# EAGLE schematic TI_MotorController (EAGLE 9.3.0)
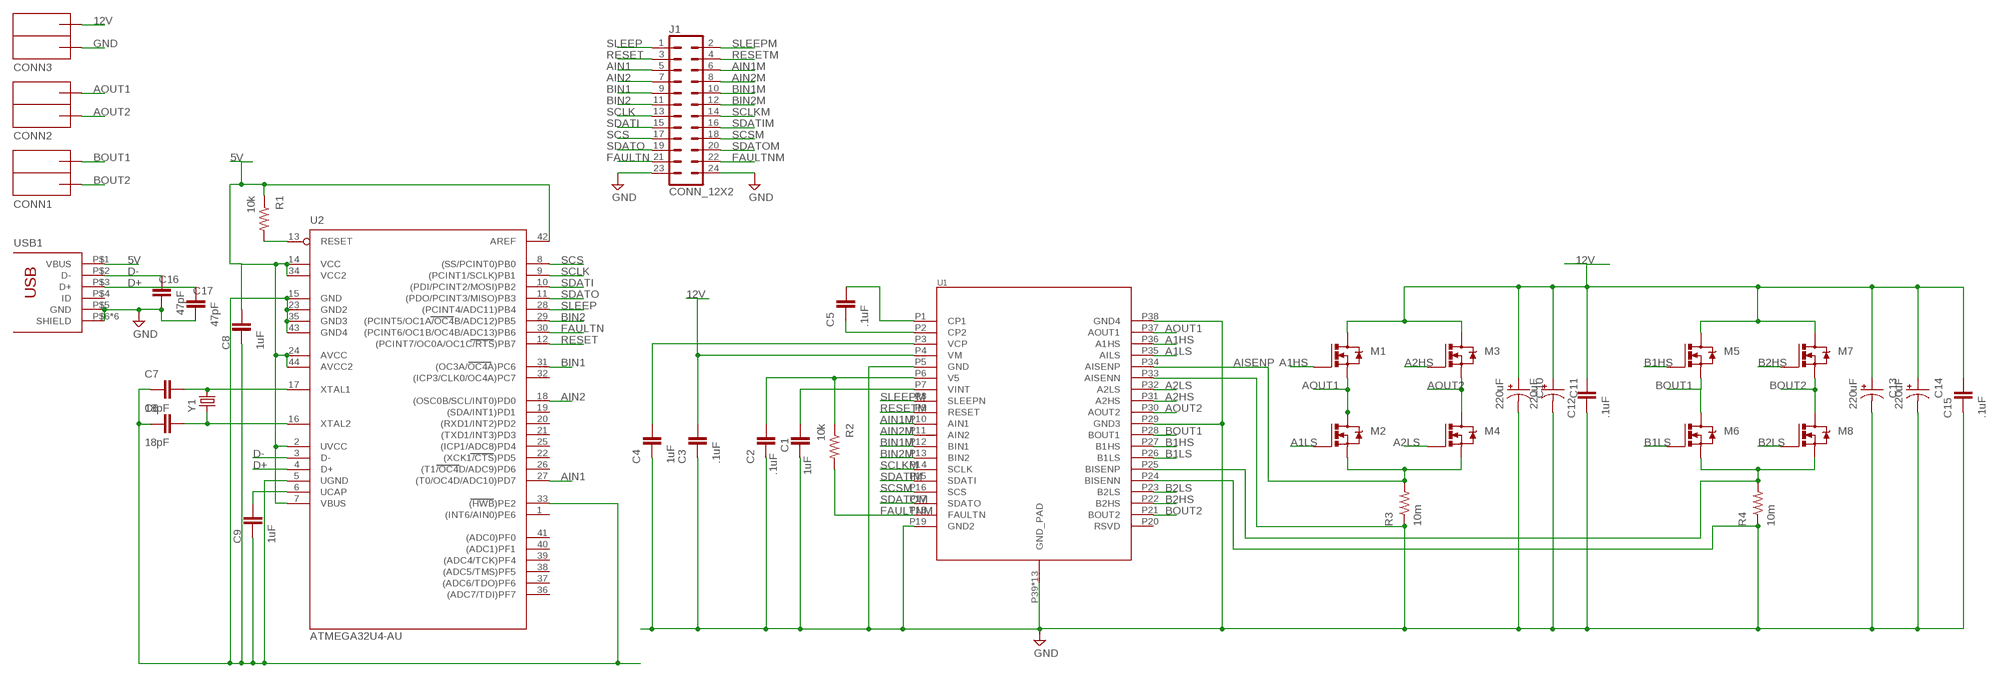
[diagram p0: schematic, sheet 1]

## Parts
C1  1uF  CAP0603-CAP  [0603-CAP]
C2  .1uF  CAP0603-CAP  [0603-CAP]
C3  .1uF  CAP0603-CAP  [0603-CAP]
C4  1uF  CAP0603-CAP  [0603-CAP]
C5  .1uF  CAP0603-CAP  [0603-CAP]
C6  18pF  CAP0603-CAP  [0603-CAP]
C7  18pF  CAP0603-CAP  [0603-CAP]
C8  1uF  CAP0603-CAP  [0603-CAP]
C9  1uF  CAP0603-CAP  [0603-CAP]
C10  220uF  CAP_POLF80  [NIPPON_F80]
C11  220uF  CAP_POLF80  [NIPPON_F80]
C12  .1uF  CAP0603-CAP  [0603-CAP]
C13  220uF  CAP_POLF80  [NIPPON_F80]
C14  220uF  CAP_POLF80  [NIPPON_F80]
C15  .1uF  CAP0603-CAP  [0603-CAP]
C16  47pF  CAP0603-CAP  [0603-CAP]
C17  47pF  CAP0603-CAP  [0603-CAP]
CONN1  ANDERSONVERTICAL  [ANDERSON_VERTICAL]
CONN2  ANDERSONVERTICAL  [ANDERSON_VERTICAL]
CONN3  ANDERSONVERTICAL  [ANDERSON_VERTICAL]
J1  CONN_12X2  [2X12]
M1  NMOS_CSD17579Q3A  [DNH0008A]
M2  NMOS_CSD17579Q3A  [DNH0008A]
M3  NMOS_CSD17579Q3A  [DNH0008A]
M4  NMOS_CSD17579Q3A  [DNH0008A]
M5  NMOS_CSD17579Q3A  [DNH0008A]
M6  NMOS_CSD17579Q3A  [DNH0008A]
M7  NMOS_CSD17579Q3A  [DNH0008A]
M8  NMOS_CSD17579Q3A  [DNH0008A]
R1  10k  R-US_R0603  [R0603]
R2  10k  R-US_R0603  [R0603]
R3  10m  R-US_R2512  [R2512]
R4  10m  R-US_R2512  [R2512]
U1  DRV8704  [HTSSOP(38)]
U2  ATMEGA32U4-AU  [TQFP44]
USB1  USB-OTGMICRO-AB  [USB-MICRO-AB]
Y1  CRYSTAL10.5X4.8  [CRYSTAL-SMD-10.5X4.8-2PIN]

## Nets
5V: C8.2 R1.1 U2.2(UVCC) U2.7(VBUS) U2.14(VCC) U2.24(AVCC) U2.34(VCC2) U2.42(AREF) U2.44(AVCC2) USB1.P$1(VBUS)
12V: C3.2 C10.+ C11.+ C12.2 C13.+ C14.+ C15.2 CONN3.PIN1(OUTB) M1.5(D) M1.6(D) M1.7(D) M1.8(D) M1.9(D) M3.5(D) M3.6(D) M3.7(D) M3.8(D) M3.9(D) M5.5(D) M5.6(D) M5.7(D) M5.8(D) M5.9(D) M7.5(D) M7.6(D) M7.7(D) M7.8(D) M7.9(D) U1.P4(VM)
A1HS: M1.4(G) U1.P36(A1HS)
A1LS: M2.4(G) U1.P35(AILS)
A2HS: M3.4(G) U1.P31(A2HS)
A2LS: M4.4(G) U1.P32(A2LS)
AIN1: J1.5 U2.27((T0/OC4D/ADC10)PD7)
AIN1M: J1.6 U1.P10(AIN1)
AIN2: J1.7 U2.18((OSC0B/SCL/INT0)PD0)
AIN2M: J1.8 U1.P11(AIN2)
AISENP: M2.1(S) M2.2(S) M2.3(S) M4.1(S) M4.2(S) M4.3(S) R3.2 U1.P34(AISENP)
AOUT1: CONN2.PIN1(OUTB) M1.1(S) M1.2(S) M1.3(S) M2.5(D) M2.6(D) M2.7(D) M2.8(D) M2.9(D) U1.P37(AOUT1)
AOUT2: CONN2.PIN2(OUTA) M3.1(S) M3.2(S) M3.3(S) M4.5(D) M4.6(D) M4.7(D) M4.8(D) M4.9(D) U1.P30(AOUT2)
B1HS: M5.4(G) U1.P27(B1HS)
B1LS: M6.4(G) U1.P26(B1LS)
B2HS: M7.4(G) U1.P22(B2HS)
B2LS: M8.4(G) U1.P23(B2LS)
BIN1: J1.9 U2.31((OC3A/OC4A)PC6)
BIN1M: J1.10 U1.P12(BIN1)
BIN2: J1.11 U2.29((PCINT5/OC1A/OC4B/ADC12)PB5)
BIN2M: J1.12 U1.P13(BIN2)
BOUT1: CONN1.PIN1(OUTB) M5.1(S) M5.2(S) M5.3(S) M6.5(D) M6.6(D) M6.7(D) M6.8(D) M6.9(D) U1.P28(BOUT1)
BOUT2: CONN1.PIN2(OUTA) M7.1(S) M7.2(S) M7.3(S) M8.5(D) M8.6(D) M8.7(D) M8.8(D) M8.9(D) U1.P21(BOUT2)
D+: C17.2 U2.4(D+) USB1.P$3(D+)
D-: C16.2 U2.3(D-) USB1.P$2(D-)
FAULTN: J1.21 U2.30((PCINT6/OC1B/OC4B/ADC13)PB6)
FAULTNM: J1.22 R2.2 U1.P18(FAULTN)
GND: C1.1 C2.1 C3.1 C4.1 C10.- C11.- C12.1 C13.- C14.- C15.1 C16.1 C17.1 CONN3.PIN2(OUTA) J1.23 J1.24 R3.1 R4.1 U1.P5(GND) U1.P19(GND2) U1.P24(BISENN) U1.P29(GND3) U1.P33(AISENN) U1.P38(GND4) U1.P39(GND_PAD) U1.P40(GND_PAD) U1.P41(GND_PAD) U1.P42(GND_PAD) U1.P43(GND_PAD) U1.P44(GND_PAD) U1.P45(GND_PAD) U1.P46(GND_PAD) U1.P47(GND_PAD) U1.P48(GND_PAD) U1.P49(GND_PAD) U1.P50(GND_PAD) U1.P51(GND_PAD) USB1.P$5(GND) USB1.P$6(SHIELD) USB1.P$7(SHIELD) USB1.P$8(SHIELD) USB1.P$9(SHIELD) USB1.P$10(SHIELD) USB1.P$11(SHIELD)
N$1: C1.2 U1.P7(VINT)
N$2: C2.2 R2.1 U1.P6(V5)
N$3: R1.2 U2.13(RESET)
N$4: C4.2 U1.P3(VCP)
N$5: C5.1 U1.P2(CP2)
N$6: C5.2 U1.P1(CP1)
N$7: C7.2 U2.17(XTAL1) Y1.P$2
N$8: C6.2 U2.16(XTAL2) Y1.P$1
N$9: C6.1 C7.1 C8.1 C9.1 U2.5(UGND) U2.15(GND) U2.23(GND2) U2.33((HWB)PE2) U2.35(GND3) U2.43(GND4)
N$11: C9.2 U2.6(UCAP)
N$16: M6.1(S) M6.2(S) M6.3(S) M8.1(S) M8.2(S) M8.3(S) R4.2 U1.P25(BISENP)
RESET: J1.3 U2.12((PCINT7/OC0A/OC1C/RTS)PB7)
RESETM: J1.4 U1.P9(RESET)
SCLK: J1.13 U2.9((PCINT1/SCLK)PB1)
SCLKM: J1.14 U1.P14(SCLK)
SCS: J1.17 U2.8((SS/PCINT0)PB0)
SCSM: J1.18 U1.P16(SCS)
SDATI: J1.15 U2.10((PDI/PCINT2/MOSI)PB2)
SDATIM: J1.16 U1.P15(SDATI)
SDATO: J1.19 U2.11((PDO/PCINT3/MISO)PB3)
SDATOM: J1.20 U1.P17(SDATO)
SLEEP: J1.1 U2.28((PCINT4/ADC11)PB4)
SLEEPM: J1.2 U1.P8(SLEEPN)
Unconnected: U1.P20(RSVD) U2.1((INT6/AIN0)PE6) U2.19((SDA/INT1)PD1) U2.20((RXD1/INT2)PD2) U2.21((TXD1/INT3)PD3) U2.22((XCK1/CTS)PD5) U2.25((ICP1/ADC8)PD4) U2.26((T1/OC4D/ADC9)PD6) U2.32((ICP3/CLK0/OC4A)PC7) U2.36((ADC7/TDI)PF7) U2.37((ADC6/TDO)PF6) U2.38((ADC5/TMS)PF5) U2.39((ADC4/TCK)PF4) U2.40((ADC1)PF1) U2.41((ADC0)PF0) USB1.P$4(ID)

## Library data of the parts
C1-C4 C6-C9 C12 C15-C17 = pie:CAP: Capacitor Standard 0603 ceramic capacitor, and 0.1" leaded capacitor.; PIE-INT-REF-NUM: CAPACITOR-GENERIC
C5 = pie:CAP: Capacitor Standard 0603 ceramic capacitor, and 0.1" leaded capacitor.; PIE-INT-REF-NUM: CAPACITOR-GENERIC; VMAX: 16V
C10 C11 C13 C14 = pie:CAP_POL: Capacitor Polarized These are standard SMD and PTH capacitors. Normally 10uF, 47uF, and 100uF in electrolytic and tantalum varieties. Always verify the external diameter of the through hole cap, it varies with capacity, voltage, and manufacturer. The EIA devices should be standard.
CONN1-CONN3 = pie:ANDERSON: 2-pin 25A Anderson Connector http://www.alliedelec.com/images/products/datasheets/bm/ANDERSON_POWER_PRODUCTS/70162018.pdf; PIE-INT-REF-NUM: Anderson
J1 = SparkFun-Connectors:CONN_12X2: Multi connection point. Often used as Generic Header-pin footprint for 0.1 inch spaced/style header connections On any of the 0.1 inch spaced packages, you can populate with these: Break Away Headers - Straight <https://www.sparkfun.com/products/116> (PRT-00116) Break Away Male Headers - Right Angle <https://www.sparkfun.com/products/553> (PRT-00553) Female Headers <https://www.sparkfun.com/products/115> (PRT-00115) Break Away Headers - Machine Pin <https://www.sparkfun.com/products/117> (PRT-00117) Break Away Female Headers - Swiss Machine Pin <https://www.sparkfun.com/products/743> (PRT-00743)
M1-M8 = pie:NMOS_CSD17579Q3A; PART_NO: CSD17579Q3A
R1 R2 = pie:R-US_: RESISTOR, American symbol; DESCRIPTION: RESISTOR, American symbol; DISTRIBUTOR: DigiKey; MANUFACTURER: Rohm Semiconductor; NOTES: Cut Tape; PACKAGE: R0603; VALUE: >VALUE
R3 R4 = pie:R-US_: RESISTOR, American symbol; PIE-INT-REF-NUM: RESISTOR-GENERIC
U1 = pie:DRV8704; PART_NO: DRV8704
U2 = pie:ATMEGA32U4-AU; PIE-DIGIKEY-PN-ALT1: ATMEGA32U4-MURCT-ND; PIE-DIGIKEY-PN-PRI: ATMEGA32U4RC-MURCT-ND; PIE-INT-REF-NUM: ATmega32U4
USB1 = pie:USB-OTG: USB Connector OTG connector with ID pin; PIE-DIGIKEY-PN-PRI: H11635CT-ND; PIE-INT-REF-NUM: USB
Y1 = pie:CRYSTAL: Various standard crystals. Proven footprints. Spark Fun Electronics SKU : COM-00534; PIE-INT-REF-NUM: CRYSTAL